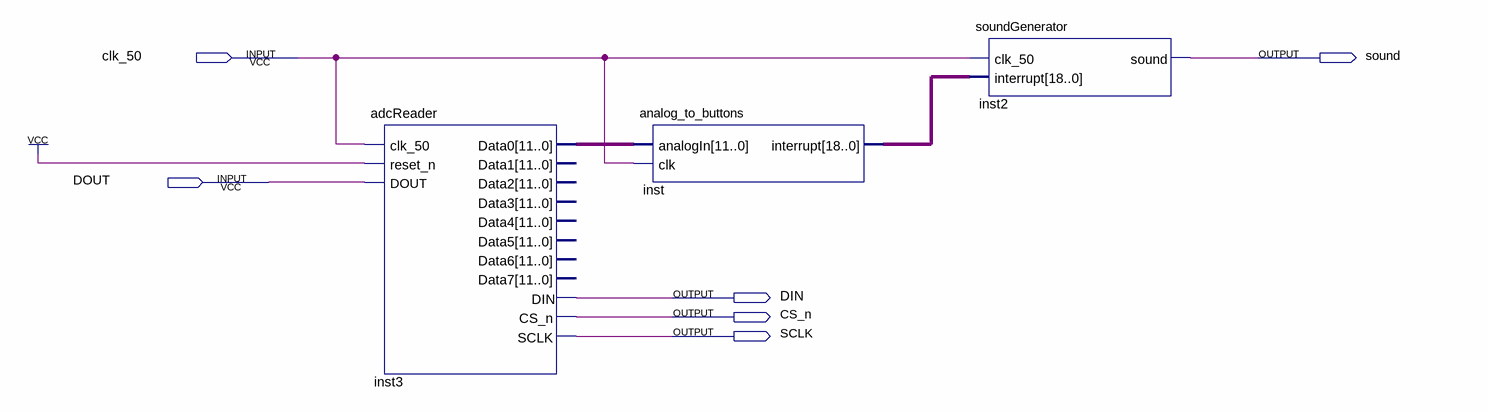
[diagram p0: schematic sheet]
// Quartus schematic sound.bdf as structural Verilog: 3 symbols, 6 pins
module sound (
  input  clk_50,
  input  DOUT,
  output sound,
  output DIN,
  output CS_n,
  output SCLK
);

  wire [11:0] inst3_data0;
  wire [18:0] inst_interrupt;

  adcReader inst3 (
    .clk_50(clk_50), .reset_n(1'b1), .DOUT(DOUT), .Data0(inst3_data0), .DIN(DIN), .CS_n(CS_n), .SCLK(SCLK));  // open: Data1, Data2, Data3, Data4, Data5, Data6, Data7
  analog_to_buttons inst (.analogIn(inst3_data0), .clk(clk_50), .interrupt(inst_interrupt));
  soundGenerator inst2 (.clk_50(clk_50), .interrupt(inst_interrupt), .sound(sound));
endmodule
